# EAGLE design lcd (EAGLE 5.11)
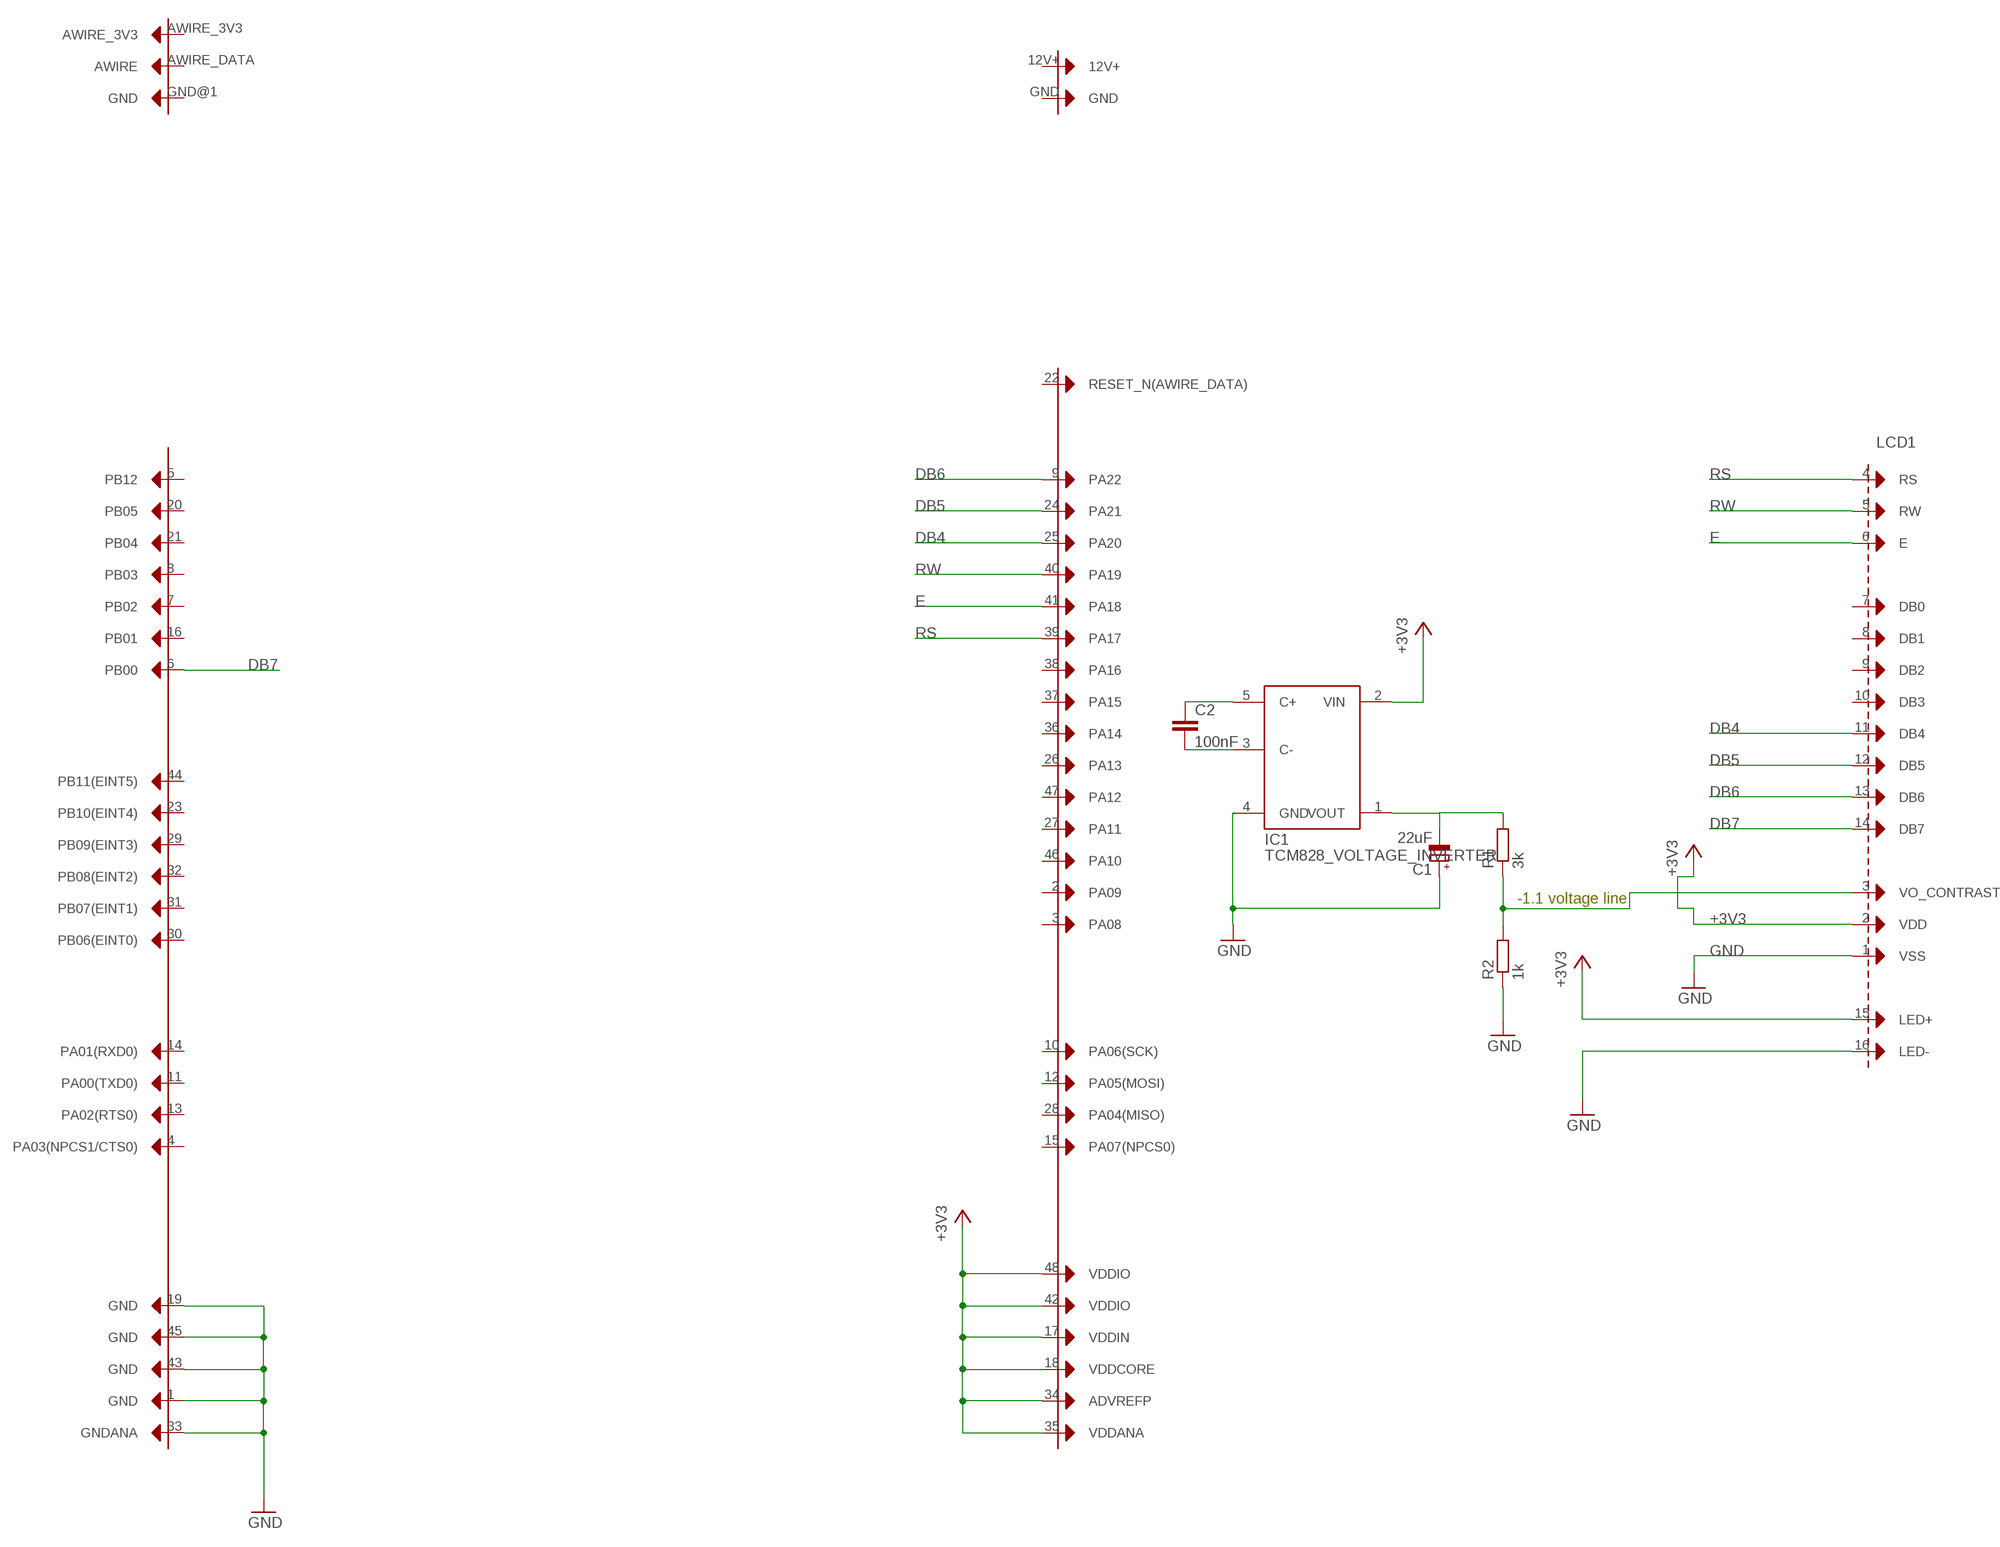
[diagram p0: schematic, sheet 1]

## Parts
C1  22uF  CPOL-EUE2,5-6E  [E2,5-6E]
C2  100nF  C-EU025-025X050  [C025-025X050]
CON1  IO_BOARD_CONNECTORUUSI  [AT32UCL_IO_BOARD_CONNECTOR_V2]
IC1  TCM828_VOLTAGE_INVERTER  [SOT23-5L]
LCD1  LCD_WITH_COMMON_INTERFACE  [LCD_FDCC0802C-NSWBBH-91LE]
R1  3k  R-EU_0411/15  [0411/15]
R2  1k  R-EU_0411/15  [0411/15]

## Nets
+3V3: CON1.17(VDDIN) CON1.18(VDDCORE) CON1.34(ADVREFP) CON1.35(VDDANA) CON1.42(VDDIO) CON1.48(VDDIO) IC1.2(VIN) LCD1.2(VDD) LCD1.15(LED+)
DB4: CON1.25(PA20) LCD1.11(DB4)
DB5: CON1.24(PA21) LCD1.12(DB5)
DB6: CON1.9(PA22) LCD1.13(DB6)
DB7: CON1.6(PB00) LCD1.14(DB7)
E: CON1.41(PA18) LCD1.6(E)
GND: C1.+ CON1.1(GND) CON1.19(GND) CON1.33(GNDANA) CON1.43(GND) CON1.45(GND) IC1.4(GND) LCD1.1(VSS) LCD1.16(LED-) R2.1
N$1: C1.- IC1.1(VOUT) R1.2
N$3: C2.1 IC1.5(C+)
N$4: C2.2 IC1.3(C-)
N$6: LCD1.3(VO_CONTRAST) R1.1 R2.2
RS: CON1.39(PA17) LCD1.4(RS)
RW: CON1.40(PA19) LCD1.5(RW)
Unconnected: CON1.2(PA09) CON1.3(PA08) CON1.4(PA03(NPCS1/CTS0)) CON1.5(PB12) CON1.7(PB02) CON1.8(PB03) CON1.10(PA06(SCK)) CON1.11(PA00(TXD0)) CON1.12(PA05(MOSI)) CON1.12V+ CON1.13(PA02(RTS0)) CON1.14(PA01(RXD0)) CON1.15(PA07(NPCS0)) CON1.16(PB01) CON1.20(PB05) CON1.21(PB04) CON1.22(RESET_N(AWIRE_DATA)) CON1.23(PB10(EINT4)) CON1.26(PA13) CON1.27(PA11) CON1.28(PA04(MISO)) CON1.29(PB09(EINT3)) CON1.30(PB06(EINT0)) CON1.31(PB07(EINT1)) CON1.32(PB08(EINT2)) CON1.36(PA14) CON1.37(PA15) CON1.38(PA16) CON1.44(PB11(EINT5)) CON1.46(PA10) CON1.47(PA12) CON1.AWIRE_3V3 CON1.AWIRE_DATA(AWIRE) CON1.GND CON1.GND@1(GND) LCD1.7(DB0) LCD1.8(DB1) LCD1.9(DB2) LCD1.10(DB3)

## Notes on the sheet
- -1.1 voltage line

## Library data of the parts
C1 = RC_and_L:CPOL-EU: POLARIZED CAPACITOR, European symbol
C2 = RC_and_L:C-EU: CAPACITOR, European symbol
CON1 = timelapse-prototype-parts:IO_BOARD_CONNECTOR
IC1 = timelapse-prototype-parts:TCM828_VOLTAGE_INVERTER
LCD1 = timelapse-prototype-parts:LCD_WITH_COMMON_INTERFACE
R1 R2 = RC_and_L:R-EU_: RESISTOR, European symbol

## Board
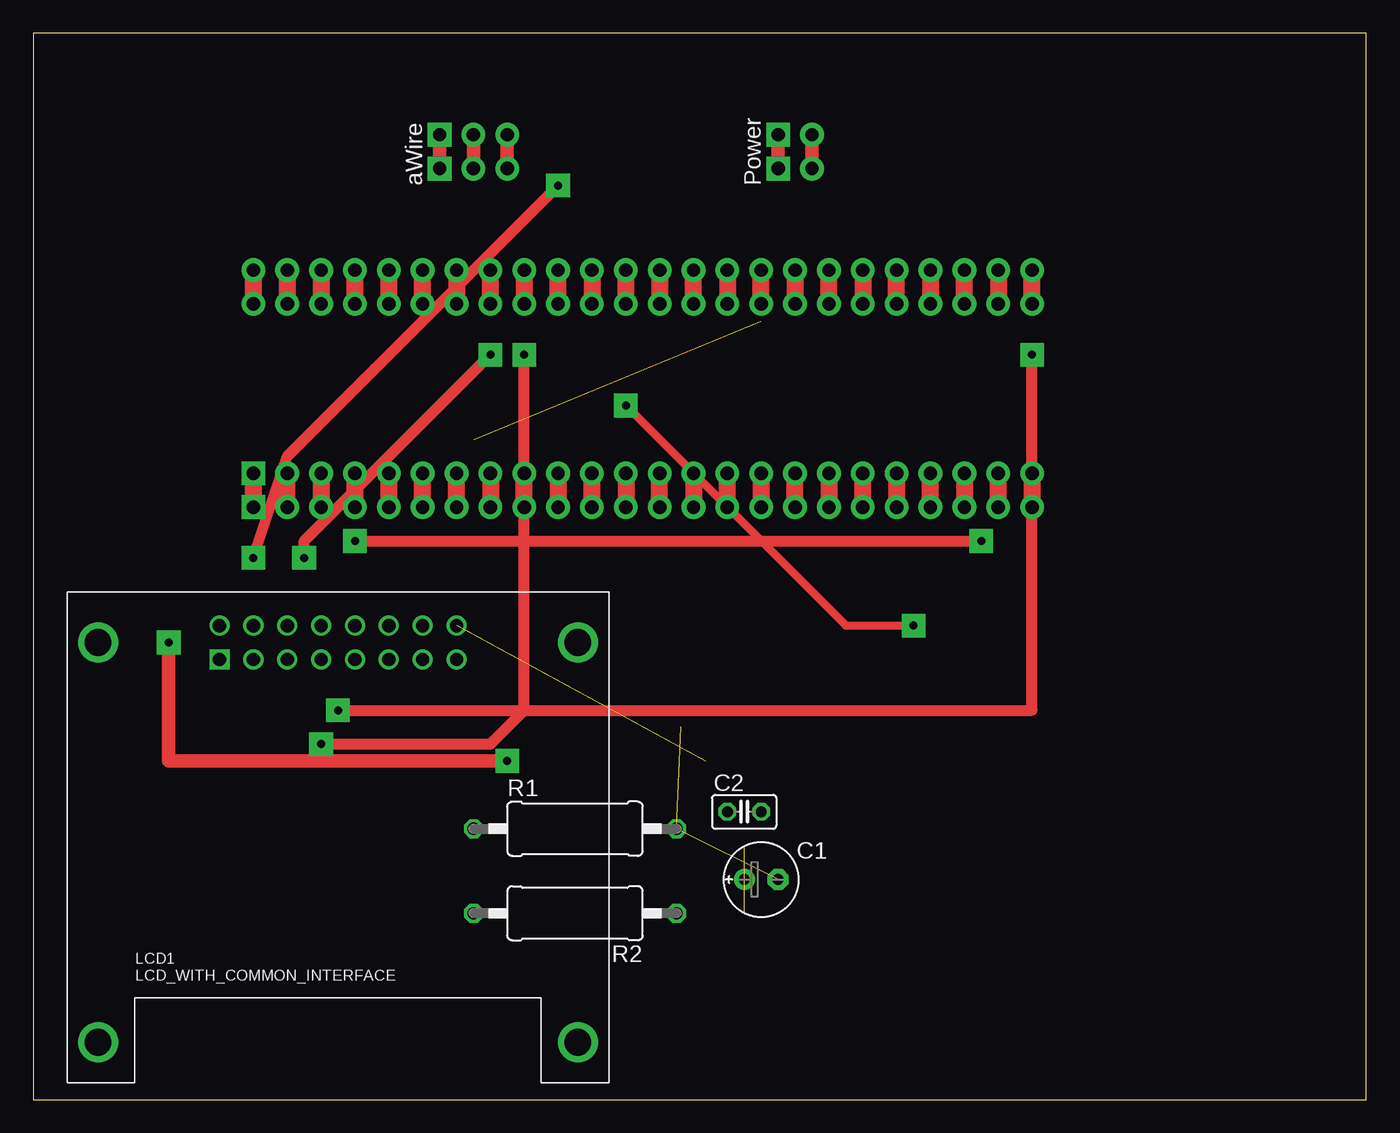
[diagram p1: board, top side]
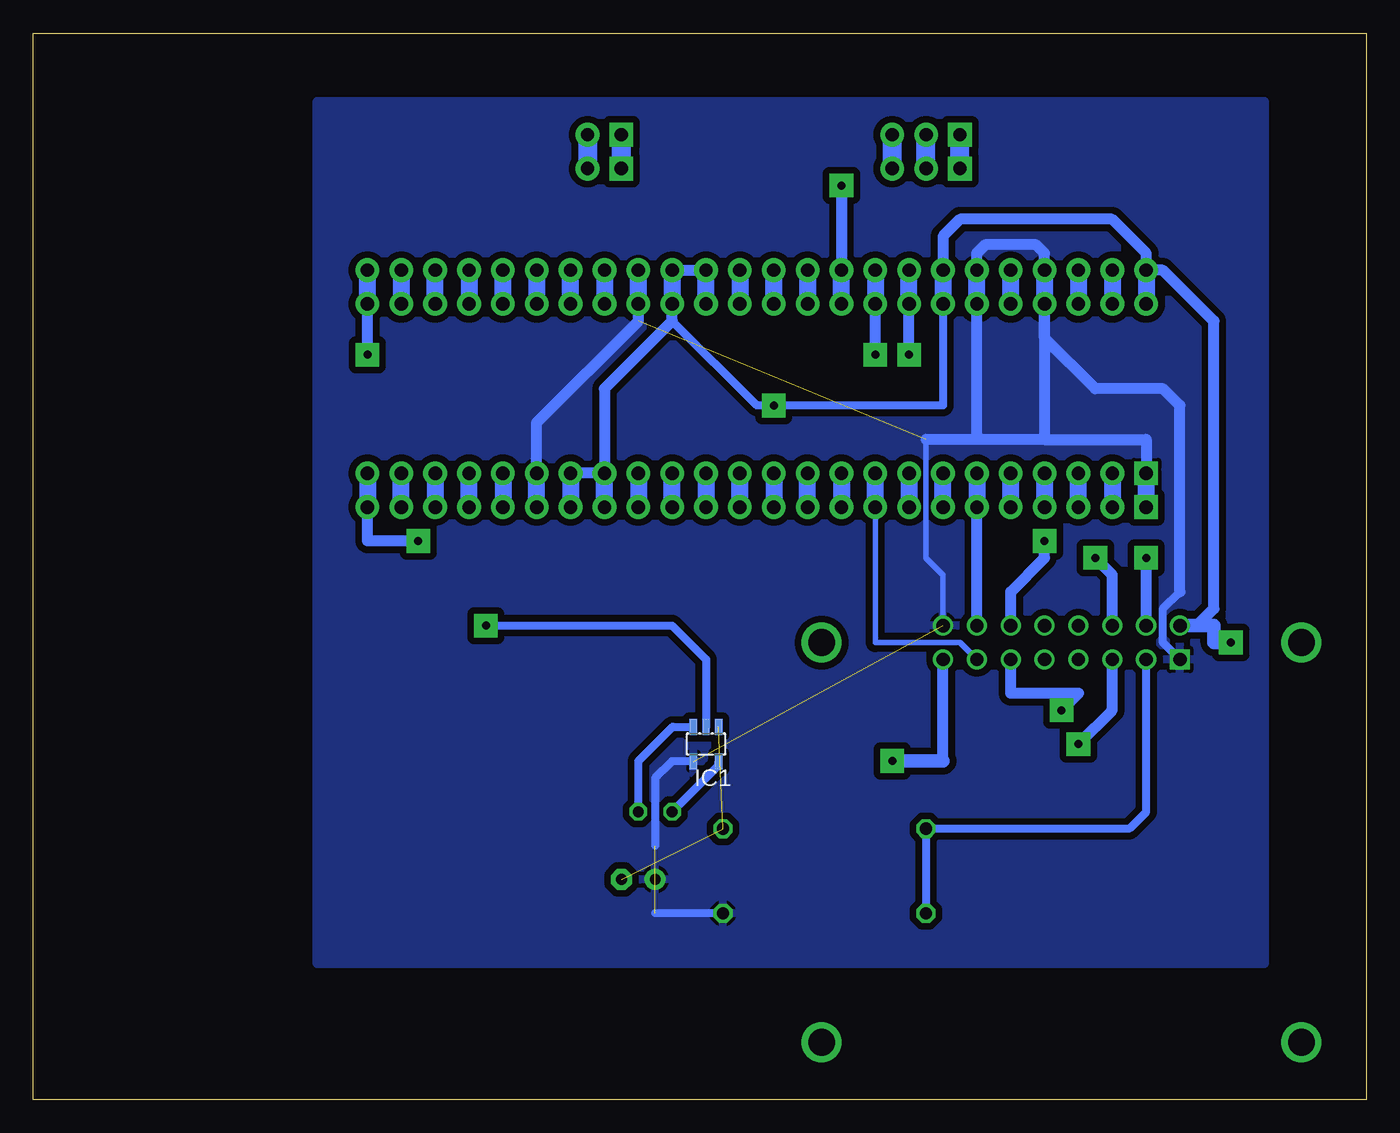
[diagram p2: board, bottom side, seen from below]

Size 100 x 80 mm. Coordinates in mm from the lower left corner, seen from the top.
Outline: 0,0 100,0 100,80 0,80 0,0
Copper layers (1*16): Top 0.035mm / dielectric 1.5mm / Bottom 0.035mm
Design rules "default *": minimum track width 10mil, minimum drill 24mil, track to track 20mil, track to pad 20mil, pad to pad 8mil, via to via 8mil, smd to smd 8mil, copper to edge 40mil, drill to drill 8mil, minimum pad ring 10mil, minimum via ring 8mil, stop-mask expansion 4mil, vias tented up to drill 0mil, thermal gap 10mil

### Footprints (pad centres in the part's own frame; a part is rotated, then mirrored left to right if it is on the bottom)
E2,5-6E = drill 0.813 pad 1.575 round: + -1.27,0 | drill 0.813 pad 1.575 octagon: - 1.27,0
C025-025X050 = drill 0.813 octagon: 1 -1.27,0; 2 1.27,0
AT32UCL_IO_BOARD_CONNECTOR_V2 = drill 1 pad 1.778 square: 1 -15.24,-19.05; 12V+ 24.13,3.81; AWIRE_DATA -1.27,3.81; NC1 -15.24,-21.59; P$100 -1.27,6.35; P$104 24.13,6.35 | drill 1 pad 1.778 round: 2 -12.7,-19.05; 3 -10.16,-19.05; 4 -7.62,-19.05; 5 -5.08,-19.05; 6 -2.54,-19.05; 7 0,-19.05; 8 2.54,-19.05; 9 5.08,-19.05; 10 7.62,-19.05; 11 10.16,-19.05; 12 12.7,-19.05; 13 15.24,-19.05; 14 17.78,-19.05; 15 20.32,-19.05; 16 22.86,-19.05; 17 25.4,-19.05; 18 27.94,-19.05; 19 30.48,-19.05; 20 33.02,-19.05; 21 35.56,-19.05; 22 38.1,-19.05; 23 40.64,-19.05; 24 43.18,-19.05; 25 43.18,-3.81; 26 40.64,-3.81; 27 38.1,-3.81; 28 35.56,-3.81; 29 33.02,-3.81; 30 30.48,-3.81; 31 27.94,-3.81; 32 25.4,-3.81; 33 22.86,-3.81; 34 20.32,-3.81; 35 17.78,-3.81; 36 15.24,-3.81; 37 12.7,-3.81; 38 10.16,-3.81; 39 7.62,-3.81; 40 5.08,-3.81; 41 2.54,-3.81; 42 0,-3.81; 43 -2.54,-3.81; 44 -5.08,-3.81; 45 -7.62,-3.81; 46 -10.16,-3.81; 47 -12.7,-3.81; 48 -15.24,-3.81; 49 43.18,-6.35; 50 40.64,-6.35; 51 38.1,-6.35; 52 35.56,-6.35; 53 33.02,-6.35; 54 30.48,-6.35; 55 27.94,-6.35; 56 25.4,-6.35; 57 22.86,-6.35; 58 20.32,-6.35; 59 17.78,-6.35; 60 15.24,-6.35; 61 12.7,-6.35; 62 10.16,-6.35; 63 7.62,-6.35; 64 5.08,-6.35; 65 2.54,-6.35; 66 0,-6.35; 67 -2.54,-6.35; 68 -5.08,-6.35; 69 -7.62,-6.35; 70 -10.16,-6.35; 71 -12.7,-6.35; 72 -15.24,-6.35; AWIRE_3V3 3.81,3.81; GND 1.27,3.81; GND@1 26.67,3.81; NC2 -12.7,-21.59; NC3 -10.16,-21.59; NC4 -7.62,-21.59; NC5 -5.08,-21.59; NC6 -2.54,-21.59; NC7 0,-21.59; NC8 2.54,-21.59; NC9 5.08,-21.59; NC10 7.62,-21.59; NC11 10.16,-21.59; NC12 12.7,-21.59; NC13 15.24,-21.59; NC14 17.78,-21.59; NC15 20.32,-21.59; NC16 22.86,-21.59; NC17 25.4,-21.59; NC18 27.94,-21.59; NC19 30.48,-21.59; NC20 33.02,-21.59; NC21 35.56,-21.59; NC22 38.1,-21.59; NC23 40.64,-21.59; NC24 43.18,-21.59; P$1 3.81,6.35; P$99 1.27,6.35; P$103 26.67,6.35
SOT23-5L = smd 0.55 x 1.2: 1 -0.95,-1.3; 2 0,-1.3; 3 0.95,-1.3; 4 0.95,1.3; 5 -0.95,1.3
LCD_FDCC0802C-NSWBBH-91LE = drill 1 square: 1 -1.27,0 | drill 1 round: 2 -1.27,2.54; 3 1.27,0; 4 1.27,2.54; 5 3.81,0; 6 3.81,2.54; 7 6.35,0; 8 6.35,2.54; 9 8.89,0; 10 8.89,2.54; 11 11.43,0; 12 11.43,2.54; 13 13.97,0; 14 13.97,2.54; 15 16.51,0; 16 16.51,2.54 | drill 2 round: P$17 -10.38,1.27; P$18 25.62,1.27; P$19 -10.38,-28.73; P$20 25.62,-28.73
0411/15 = drill 0.914 octagon: 1 -7.62,0; 2 7.62,0

### Placement (x,y rotation side)
C1  54.61,16.51 0 top
C2  53.34,21.59 0 top
CON1  31.75,66.04 0 top
IC1  49.53,26.67 180 bottom
LCD1  15.24,33.02 0 top
R1  40.64,20.32 0 top
R2  40.64,13.97 180 top

### Tracks (layer width: path | path; a pad name or v marks a point on that pad's centre or on a via)
+3V3  (via drill 0.6 pad 1.78)
  Top 0.61: v66.04,35.56 60.96,35.56 v44.45,52.07
  Top 1.016: v35.56,25.4 10.16,25.4 v10.16,34.29
  Bottom 0.61: 52.07,58.42 45.72,52.07 v44.45,52.07 31.75,52.07 CON1.42 | IC1.2 49.53,33.02 52.07,35.56 v66.04,35.56
  Bottom 0.813: CON1.35 CON1.34 52.07,58.42 57.15,53.34 CON1.17 CON1.18 | CON1.42 31.75,64.77 30.48,66.04 19.05,66.04 16.51,63.5 CON1.48 15.24,62.23 11.43,58.42 11.43,36.83 12.7,35.56 LCD1.2 | 31.75,25.4 LCD1.15
  Bottom 1.016: v35.56,25.4 31.75,25.4 | v10.16,34.29 11.43,34.29 11.43,35.56 LCD1.2
DB4  (via drill 0.6 pad 1.78)
  Top 0.813: v22.86,29.21 74.93,29.21 v74.93,55.88
  Bottom 0.813: v22.86,29.21 21.59,30.48 26.67,30.48 LCD1.11 | v74.93,55.88 CON1.25
DB5  (via drill 0.6 pad 1.78)
  Top 0.813: v24.13,41.91 v71.12,41.91
  Bottom 0.813: v71.12,41.91 74.93,41.91 CON1.24 | v24.13,41.91 24.13,40.64 26.67,38.1 LCD1.12
DB6
  Bottom 0.406: CON1.9 36.83,34.29 30.48,34.29 LCD1.13
DB7
  Bottom 0.813: LCD1.14 CON1.6
E  (via drill 0.6 pad 1.78)
  Top 0.813: v20.32,40.64 20.32,41.91 v34.29,55.88
  Bottom 0.813: LCD1.6 19.05,39.37 v20.32,40.64 | v34.29,55.88 CON1.41
GND  (4 unrouted)
  Bottom 0.406: LCD1.16 31.75,39.37 33.02,40.64 33.02,49.53
  Bottom 0.61: LCD1.1 15.24,34.29 15.24,36.83 13.97,38.1 | IC1.4 52.1,25.37 53.34,24.13 53.34,19.05 | R2.1 53.34,13.97
  Bottom 0.813: CON1.19 62.23,50.8 54.61,58.42 CON1.33 | 29.21,49.53 CON1.43 29.21,63.5 28.57,64.14 24.77,64.14 24.13,63.5 CON1.45 | CON1.1 16.51,49.53 24.13,49.53 | 24.13,49.53 29.21,49.53 | 29.21,49.53 33.02,49.53 | CON1.45 24.13,49.53 | CON1.45 24.13,57.15 20.32,53.34 15.24,53.34 13.97,52.07 13.97,38.1
  pour Bottom: 7.62,74.93 7.62,10.16 78.74,10.16 78.74,74.93
N$1  (2 unrouted)
N$3
  Bottom 0.61: IC1.5 48.58,25.08 C2.1
N$4
  Bottom 0.61: IC1.3 52.04,27.97 54.61,25.4 C2.2
N$6
  Bottom 0.61: R2.2 R1.1 17.78,20.32 16.51,21.59 LCD1.3
RS  (via drill 0.6 pad 1.78)
  Top 0.813: v16.51,40.64 19.05,48.26 v39.37,68.58
  Bottom 0.813: LCD1.4 v16.51,40.64 | v39.37,68.58 CON1.39
RW  (via drill 0.6 pad 1.78)
  Top 0.813: v21.59,26.67 34.29,26.67 36.83,29.21 v36.83,55.88
  Bottom 0.813: LCD1.5 19.05,29.21 v21.59,26.67 | v36.83,55.88 CON1.40